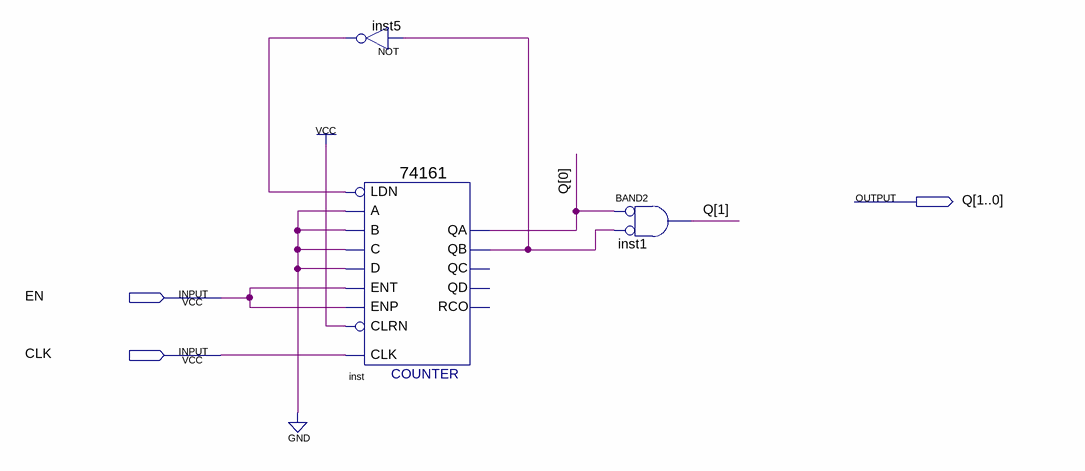
[diagram p0: schematic sheet]
// Quartus schematic M3.bdf as structural Verilog: 3 symbols, 3 pins
module M3 (
  input  EN,
  input  CLK,
  output [1:0] Q
);

  wire inst5_out, inst_qb;

  not inst5 (inst5_out, inst_qb);
  \74161  inst (
    .CLRN(1'b1), .CLK(CLK), .ENP(EN), .LDN(inst5_out), .A(1'b0), .D(1'b0), .ENT(EN), .B(1'b0), .C(1'b0),
    .QB(inst_qb), .QA(Q[0]));  // open: QD, QC, RCO
  and inst1 (Q[1], ~Q[0], ~inst_qb);  // BAND2
endmodule
